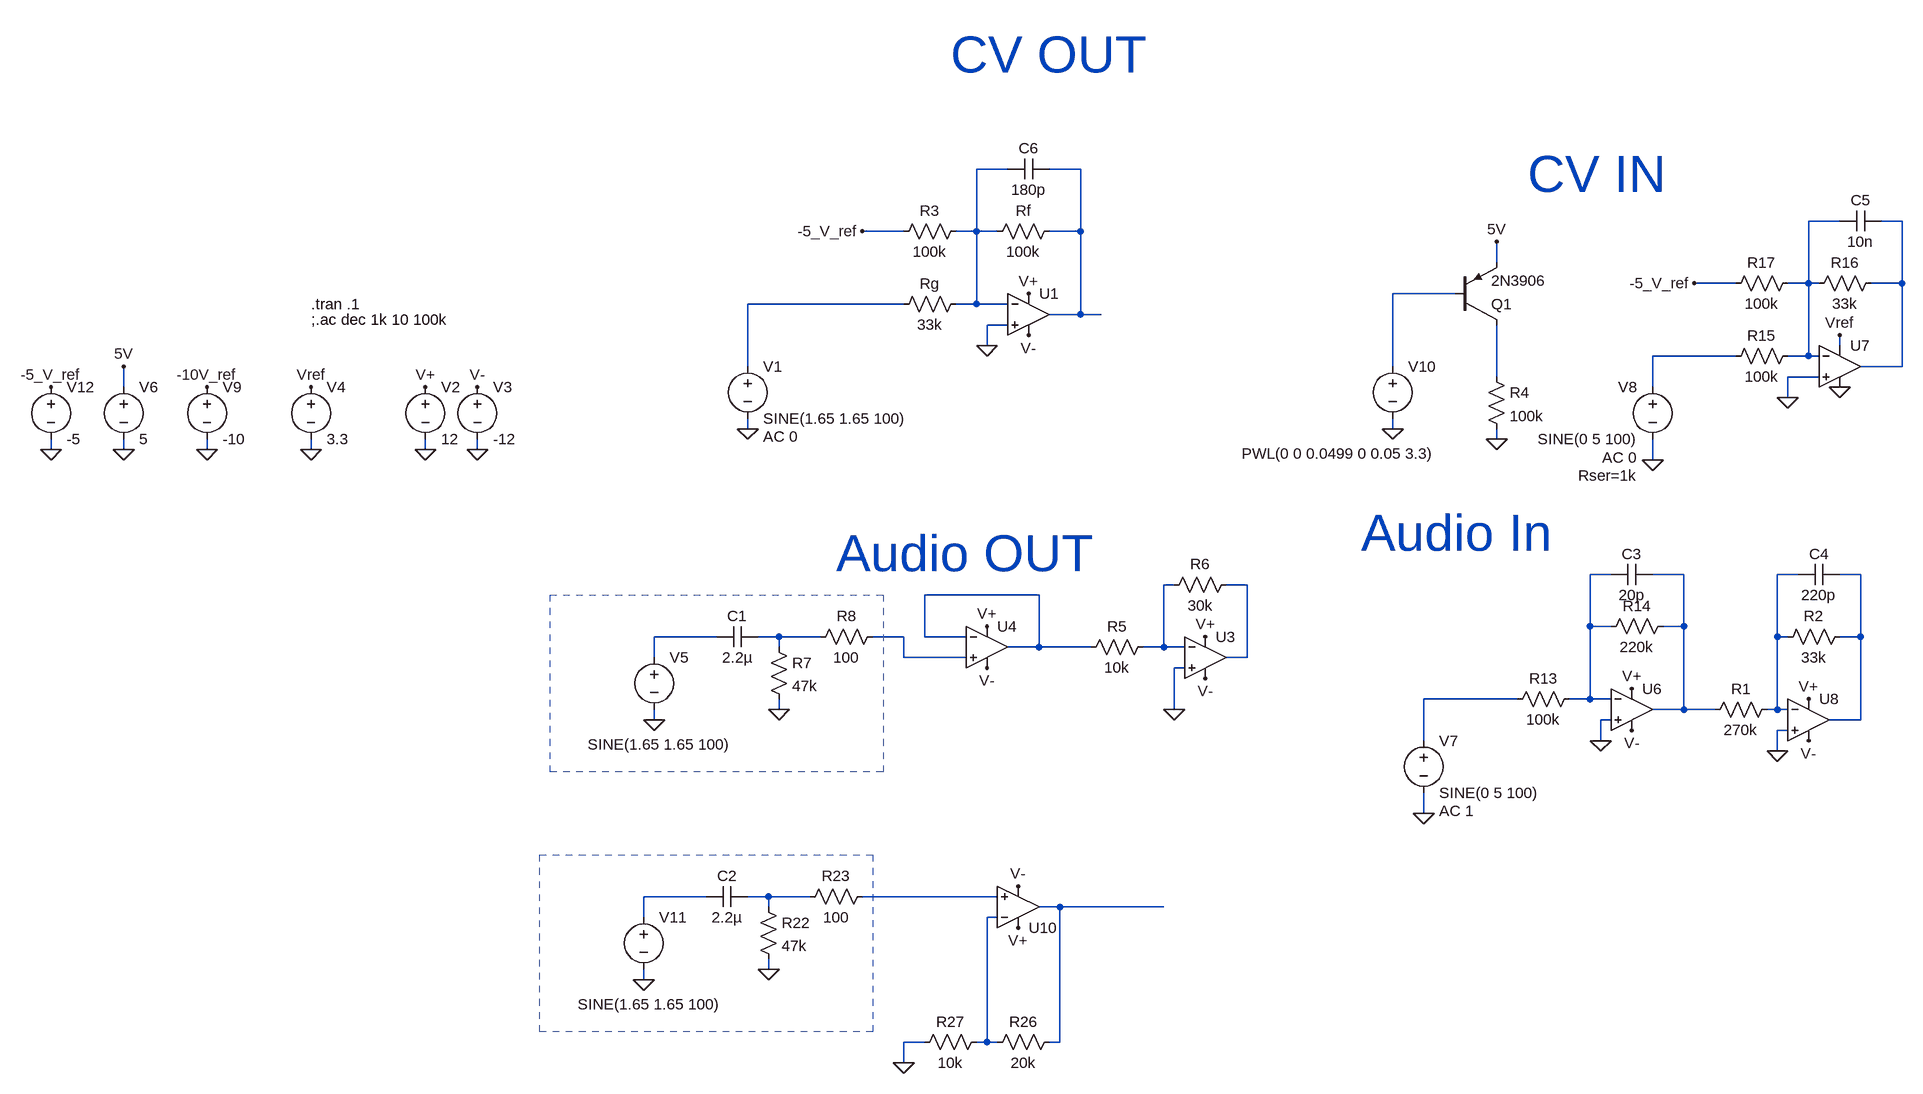
[diagram p0: schematic seed_interface.asc]
seed_interface.asc, the LTspice schematic file:
Version 4
SHEET 1 2700 1272
WIRE 512 -176 464 -176
WIRE 624 -176 576 -176
WIRE 1792 -96 1744 -96
WIRE 1888 -96 1856 -96
WIRE 352 -80 288 -80
WIRE 464 -80 464 -176
WIRE 464 -80 432 -80
WIRE 496 -80 464 -80
WIRE 624 -80 624 -176
WIRE 624 -80 576 -80
WIRE 1264 -32 1264 -64
WIRE 1632 0 1568 0
WIRE 1744 0 1744 -96
WIRE 1744 0 1712 0
WIRE 1760 0 1744 0
WIRE 1888 0 1888 -96
WIRE 1888 0 1840 0
WIRE 1200 16 1104 16
WIRE 352 32 112 32
WIRE 464 32 464 -80
WIRE 464 32 432 32
WIRE 512 32 464 32
WIRE 624 48 624 -80
WIRE 624 48 576 48
WIRE 656 48 624 48
WIRE 512 64 480 64
WIRE 480 96 480 64
WIRE 1792 96 1792 80
WIRE 1632 112 1504 112
WIRE 1744 112 1744 0
WIRE 1744 112 1712 112
WIRE 1760 112 1744 112
WIRE 112 128 112 32
WIRE 1104 128 1104 16
WIRE 1888 128 1888 0
WIRE 1888 128 1824 128
WIRE 1264 144 1264 64
WIRE 1760 144 1712 144
WIRE -848 160 -848 128
WIRE 1504 160 1504 112
WIRE 1712 176 1712 144
WIRE 112 224 112 208
WIRE 1104 224 1104 208
WIRE 1264 240 1264 224
WIRE -960 256 -960 240
WIRE -848 256 -848 240
WIRE -720 256 -720 240
WIRE -560 256 -560 240
WIRE -384 256 -384 240
WIRE -304 256 -304 240
WIRE 1504 272 1504 240
WIRE 1440 448 1408 448
WIRE 1552 448 1504 448
WIRE 1728 448 1696 448
WIRE 1824 448 1792 448
WIRE 768 464 752 464
WIRE 880 464 848 464
WIRE 560 480 384 480
WIRE 1408 528 1408 448
WIRE 1440 528 1408 528
WIRE 1552 528 1552 448
WIRE 1552 528 1520 528
WIRE 64 544 -32 544
WIRE 160 544 128 544
WIRE 224 544 160 544
WIRE 352 544 304 544
WIRE 384 544 384 480
WIRE 448 544 384 544
WIRE 1696 544 1696 448
WIRE 1712 544 1696 544
WIRE 1824 544 1824 448
WIRE 1824 544 1792 544
WIRE 160 560 160 544
WIRE 560 560 560 480
WIRE 560 560 512 560
WIRE 640 560 560 560
WIRE 752 560 752 464
WIRE 752 560 720 560
WIRE 784 560 752 560
WIRE -32 576 -32 544
WIRE 352 576 352 544
WIRE 448 576 352 576
WIRE 880 576 880 464
WIRE 880 576 848 576
WIRE 784 592 768 592
WIRE 1296 640 1152 640
WIRE 1408 640 1408 528
WIRE 1408 640 1376 640
WIRE 1440 640 1408 640
WIRE 160 656 160 640
WIRE 768 656 768 592
WIRE 1552 656 1552 528
WIRE 1552 656 1504 656
WIRE 1600 656 1552 656
WIRE 1696 656 1696 544
WIRE 1696 656 1680 656
WIRE 1712 656 1696 656
WIRE -32 672 -32 656
WIRE 1440 672 1424 672
WIRE 1824 672 1824 544
WIRE 1824 672 1776 672
WIRE 1712 688 1696 688
WIRE 1152 704 1152 640
WIRE 1424 704 1424 672
WIRE 1696 720 1696 688
WIRE 1152 816 1152 784
WIRE 48 944 -48 944
WIRE 144 944 112 944
WIRE 208 944 144 944
WIRE 496 944 288 944
WIRE 144 960 144 944
WIRE 592 960 560 960
WIRE 752 960 592 960
WIRE -48 976 -48 944
WIRE 496 976 480 976
WIRE 144 1056 144 1040
WIRE -48 1072 -48 1056
WIRE 384 1168 352 1168
WIRE 480 1168 480 976
WIRE 480 1168 464 1168
WIRE 496 1168 480 1168
WIRE 592 1168 592 960
WIRE 592 1168 576 1168
WIRE 352 1200 352 1168
FLAG 112 224 0
FLAG -304 256 0
FLAG -384 256 0
FLAG -384 160 V+
FLAG 544 16 V+
FLAG -304 160 V-
FLAG 544 80 V-
FLAG -560 256 0
FLAG -560 160 Vref
FLAG -32 672 0
FLAG 816 544 V+
FLAG 816 608 V-
FLAG 768 656 0
FLAG 160 656 0
FLAG 480 528 V+
FLAG 480 592 V-
FLAG 1152 816 0
FLAG 1472 624 V+
FLAG 1472 688 V-
FLAG 1424 704 0
FLAG 1504 272 0
FLAG 1792 160 0
FLAG 1792 80 Vref
FLAG -720 256 0
FLAG -720 160 -10V_ref
FLAG 1712 176 0
FLAG 1744 640 V+
FLAG 1744 704 V-
FLAG 1696 720 0
FLAG -48 1072 0
FLAG 144 1056 0
FLAG 528 992 V+
FLAG 528 928 V-
FLAG 352 1200 0
FLAG 480 96 0
FLAG -848 256 0
FLAG -848 128 5V
FLAG 1264 -64 5V
FLAG 1104 224 0
FLAG 1264 240 0
FLAG -960 256 0
FLAG -960 160 -5_V_ref
FLAG 1568 0 -5_V_ref
FLAG 288 -80 -5_V_ref
SYMBOL voltage 112 112 R0
WINDOW 123 24 124 Left 2
WINDOW 39 0 0 Left 0
SYMATTR Value2 AC 0
SYMATTR InstName V1
SYMATTR Value SINE(1.65 1.65 100)
SYMBOL voltage -384 144 R0
WINDOW 123 0 0 Left 0
WINDOW 39 0 0 Left 0
SYMATTR InstName V2
SYMATTR Value 12
SYMBOL voltage -304 144 R0
WINDOW 123 0 0 Left 0
WINDOW 39 0 0 Left 0
SYMATTR InstName V3
SYMATTR Value -12
SYMBOL Opamps\\UniversalOpAmp1 544 48 R0
SYMATTR InstName U1
SYMBOL res 448 16 R90
WINDOW 0 0 56 VBottom 2
WINDOW 3 32 56 VTop 2
SYMATTR InstName Rg
SYMATTR Value 33k
SYMATTR SpiceLine pwr=0.33mW
SYMBOL res 592 -96 R90
WINDOW 0 0 56 VBottom 2
WINDOW 3 32 56 VTop 2
SYMATTR InstName Rf
SYMATTR Value 100k
SYMATTR SpiceLine pwr=0.25mW
SYMBOL voltage -560 144 R0
WINDOW 123 0 0 Left 0
WINDOW 39 0 0 Left 0
SYMATTR InstName V4
SYMATTR Value 3.3
SYMBOL Opamps\\UniversalOpAmp1 816 576 R0
SYMATTR InstName U3
SYMBOL voltage -32 560 R0
WINDOW 3 -102 150 Left 2
WINDOW 123 0 0 Left 0
WINDOW 39 0 0 Left 0
SYMATTR Value SINE(1.65 1.65 100)
SYMATTR InstName V5
SYMBOL res 736 544 R90
WINDOW 0 0 56 VBottom 2
WINDOW 3 32 56 VTop 2
SYMATTR InstName R5
SYMATTR Value 10k
SYMBOL res 864 448 R90
WINDOW 0 0 56 VBottom 2
WINDOW 3 32 56 VTop 2
SYMATTR InstName R6
SYMATTR Value 30k
SYMBOL cap 128 528 R90
WINDOW 0 0 32 VBottom 2
WINDOW 3 32 32 VTop 2
SYMATTR InstName C1
SYMATTR Value 2.2µ
SYMBOL res 144 544 R0
SYMATTR InstName R7
SYMATTR Value 47k
SYMBOL res 320 528 R90
WINDOW 0 0 56 VBottom 2
WINDOW 3 32 56 VTop 2
SYMATTR InstName R8
SYMATTR Value 100
SYMBOL Opamps\\UniversalOpAmp1 480 560 R0
SYMATTR InstName U4
SYMBOL voltage 1152 688 R0
WINDOW 123 24 124 Left 2
WINDOW 39 0 0 Left 0
SYMATTR Value2 AC 1
SYMATTR InstName V7
SYMATTR Value SINE(0 5 100)
SYMBOL res 1392 624 R90
WINDOW 0 0 56 VBottom 2
WINDOW 3 32 56 VTop 2
SYMATTR InstName R13
SYMATTR Value 100k
SYMBOL res 1536 512 R90
WINDOW 0 0 56 VBottom 2
WINDOW 3 32 56 VTop 2
SYMATTR InstName R14
SYMATTR Value 220k
SYMBOL res 1728 96 R90
WINDOW 0 0 56 VBottom 2
WINDOW 3 32 56 VTop 2
SYMATTR InstName R15
SYMATTR Value 100k
SYMATTR SpiceLine pwr=0.25mW
SYMBOL res 1856 -16 R90
WINDOW 0 0 56 VBottom 2
WINDOW 3 32 56 VTop 2
SYMATTR InstName R16
SYMATTR Value 33k
SYMATTR SpiceLine pwr=0.33mW
SYMBOL voltage 1504 144 M0
WINDOW 123 24 124 Left 2
WINDOW 39 24 152 Left 2
SYMATTR Value2 AC 0
SYMATTR SpiceLine Rser=1k
SYMATTR InstName V8
SYMATTR Value SINE(0 5 100)
SYMBOL voltage -720 144 R0
WINDOW 123 0 0 Left 0
WINDOW 39 0 0 Left 0
SYMATTR InstName V9
SYMATTR Value -10
SYMBOL res 1728 -16 R90
WINDOW 0 0 56 VBottom 2
WINDOW 3 32 56 VTop 2
SYMATTR InstName R17
SYMATTR Value 100k
SYMATTR SpiceLine pwr=0.5mW
SYMBOL Opamps\\UniversalOpamp2 1792 128 R0
SYMATTR InstName U7
SYMBOL Opamps\\UniversalOpamp2 1472 656 R0
SYMATTR InstName U6
SYMBOL Opamps\\UniversalOpamp2 1744 672 R0
SYMATTR InstName U8
SYMBOL res 1696 640 R90
WINDOW 0 0 56 VBottom 2
WINDOW 3 32 56 VTop 2
SYMATTR InstName R1
SYMATTR Value 270k
SYMBOL res 1808 528 R90
WINDOW 0 0 56 VBottom 2
WINDOW 3 32 56 VTop 2
SYMATTR InstName R2
SYMATTR Value 33k
SYMBOL voltage -48 960 R0
WINDOW 3 -102 150 Left 2
WINDOW 123 0 0 Left 0
WINDOW 39 0 0 Left 0
SYMATTR Value SINE(1.65 1.65 100)
SYMATTR InstName V11
SYMBOL cap 112 928 R90
WINDOW 0 0 32 VBottom 2
WINDOW 3 32 32 VTop 2
SYMATTR InstName C2
SYMATTR Value 2.2µ
SYMBOL res 128 944 R0
SYMATTR InstName R22
SYMATTR Value 47k
SYMBOL res 304 928 R90
WINDOW 0 0 56 VBottom 2
WINDOW 3 32 56 VTop 2
SYMATTR InstName R23
SYMATTR Value 100
SYMBOL Opamps\\UniversalOpamp2 528 960 M180
SYMATTR InstName U10
SYMBOL res 592 1152 R90
WINDOW 0 0 56 VBottom 2
WINDOW 3 32 56 VTop 2
SYMATTR InstName R26
SYMATTR Value 20k
SYMBOL res 480 1152 R90
WINDOW 0 0 56 VBottom 2
WINDOW 3 32 56 VTop 2
SYMATTR InstName R27
SYMATTR Value 10k
SYMBOL cap 1504 432 R90
WINDOW 0 0 32 VBottom 2
WINDOW 3 32 32 VTop 2
SYMATTR InstName C3
SYMATTR Value 20p
SYMBOL cap 1792 432 R90
WINDOW 0 0 32 VBottom 2
WINDOW 3 32 32 VTop 2
SYMATTR InstName C4
SYMATTR Value 220p
SYMBOL cap 1856 -112 R90
WINDOW 0 0 32 VBottom 2
WINDOW 3 32 32 VTop 2
SYMATTR InstName C5
SYMATTR Value 10n
SYMBOL res 448 -96 R90
WINDOW 0 0 56 VBottom 2
WINDOW 3 32 56 VTop 2
SYMATTR InstName R3
SYMATTR Value 100k
SYMATTR SpiceLine pwr=0.5mW
SYMBOL cap 576 -192 R90
WINDOW 0 0 32 VBottom 2
WINDOW 3 32 32 VTop 2
SYMATTR InstName C6
SYMATTR Value 180p
SYMBOL voltage -848 144 R0
WINDOW 123 0 0 Left 0
WINDOW 39 0 0 Left 0
SYMATTR InstName V6
SYMATTR Value 5
SYMBOL voltage 1104 112 R0
WINDOW 3 -232 150 Left 2
WINDOW 123 0 0 Left 0
WINDOW 39 0 0 Left 0
SYMATTR Value PWL(0 0 0.0499 0 0.05 3.3)
SYMATTR InstName V10
SYMBOL res 1248 128 R0
SYMATTR InstName R4
SYMATTR Value 100k
SYMBOL pnp 1200 64 M180
SYMATTR InstName Q1
SYMATTR Value 2N3906
SYMBOL voltage -960 144 R0
WINDOW 123 0 0 Left 0
WINDOW 39 0 0 Left 0
SYMATTR InstName V12
SYMATTR Value -5
TEXT -560 32 Left 2 !.tran .1
TEXT 424 -352 Left 6 ;CV OUT
TEXT 248 416 Left 6 ;Audio OUT
TEXT 1312 -168 Left 6 ;CV IN
TEXT 1056 384 Left 6 ;Audio In
TEXT -560 56 Left 2 !;.ac dec 1k 10 100k
RECTANGLE Normal 320 752 -192 480 2
RECTANGLE Normal 304 1152 -208 880 2

The netlist it stands for:
* seed_interface.asc
V1 N006 0 SINE(1.65 1.65 100) AC 0
V2 V+ 0 12
V3 V- 0 -12
XU1 0 N001 V+ V- N002 level1 Avol=1Meg GBW=10Meg Vos=0 En=0 Enk=0 In=0 Ink=0 Rin=500Meg  ; pins In+ In- V+ V- OUT
Rg N001 N006 33k pwr=0.33mW
Rf N002 N001 100k pwr=0.25mW
V4 Vref 0 3.3
XU3 0 N013 V+ V- N014 level1 Avol=1Meg GBW=10Meg Vos=0 En=0 Enk=0 In=0 Ink=0 Rin=500Meg  ; pins In+ In- V+ V- OUT
V5 N016 0 SINE(1.65 1.65 100)
R5 N013 N015 10k
R6 N014 N013 30k
C1 N017 N016 2.2µ
R7 N017 0 47k
R8 N018 N017 100
XU4 N018 N015 V+ V- N015 level1 Avol=1Meg GBW=10Meg Vos=0 En=0 Enk=0 In=0 Ink=0 Rin=500Meg  ; pins In+ In- V+ V- OUT
V7 N019 0 SINE(0 5 100) AC 1
R13 N009 N019 100k
R14 N010 N009 220k
R15 N003 N007 100k pwr=0.25mW
R16 N004 N003 33k pwr=0.33mW
V8 N007 0 SINE(0 5 100) AC 0 Rser=1k
V9 -10V_ref 0 -10
R17 N003 -5_V_ref 100k pwr=0.5mW
XU7 0 N003 Vref 0 N004 level.2 Avol=1Meg GBW=10Meg Slew=10Meg ilimit=25m rail=0 Vos=0 phimargin=45 en=0 enk=0 in=0 ink=0 Rin=500Meg  ; pins IN+ IN- V+ V- OUT
XU6 0 N009 V+ V- N010 level.2 Avol=1Meg GBW=10Meg Slew=10Meg ilimit=25m rail=0 Vos=0 phimargin=45 en=0 enk=0 in=0 ink=0 Rin=500Meg  ; pins IN+ IN- V+ V- OUT
XU8 0 N011 V+ V- N012 level.2 Avol=1Meg GBW=10Meg Slew=10Meg ilimit=25m rail=0 Vos=0 phimargin=45 en=0 enk=0 in=0 ink=0 Rin=500Meg  ; pins IN+ IN- V+ V- OUT
R1 N011 N010 270k
R2 N012 N011 33k
V11 N020 0 SINE(1.65 1.65 100)
C2 N021 N020 2.2µ
R22 N021 0 47k
R23 N022 N021 100
XU10 N022 N024 V+ V- N023 level.2 Avol=1Meg GBW=10Meg Slew=10Meg ilimit=25m rail=0 Vos=0 phimargin=45 en=0 enk=0 in=0 ink=0 Rin=500Meg  ; pins IN+ IN- V+ V- OUT
R26 N023 N024 20k
R27 N024 0 10k
C3 N010 N009 20p
C4 N012 N011 220p
C5 N004 N003 10n
R3 N001 -5_V_ref 100k pwr=0.5mW
C6 N002 N001 180p
V6 5V 0 5
V10 N005 0 PWL(0 0 0.0499 0 0.05 3.3)
R4 N008 0 100k
Q1 N008 N005 5V 0 2N3906
V12 -5_V_ref 0 -5
.model NPN NPN
.model PNP PNP
.lib standard.bjt
.tran .1
* CV OUT
* Audio OUT
* CV IN
* Audio In
;.ac dec 1k 10 100k
.lib UniversalOpAmp1.lib
.lib UniversalOpamps2.sub
.backanno
.end